# Altium project nrf52840_qfaa.PrjPCB
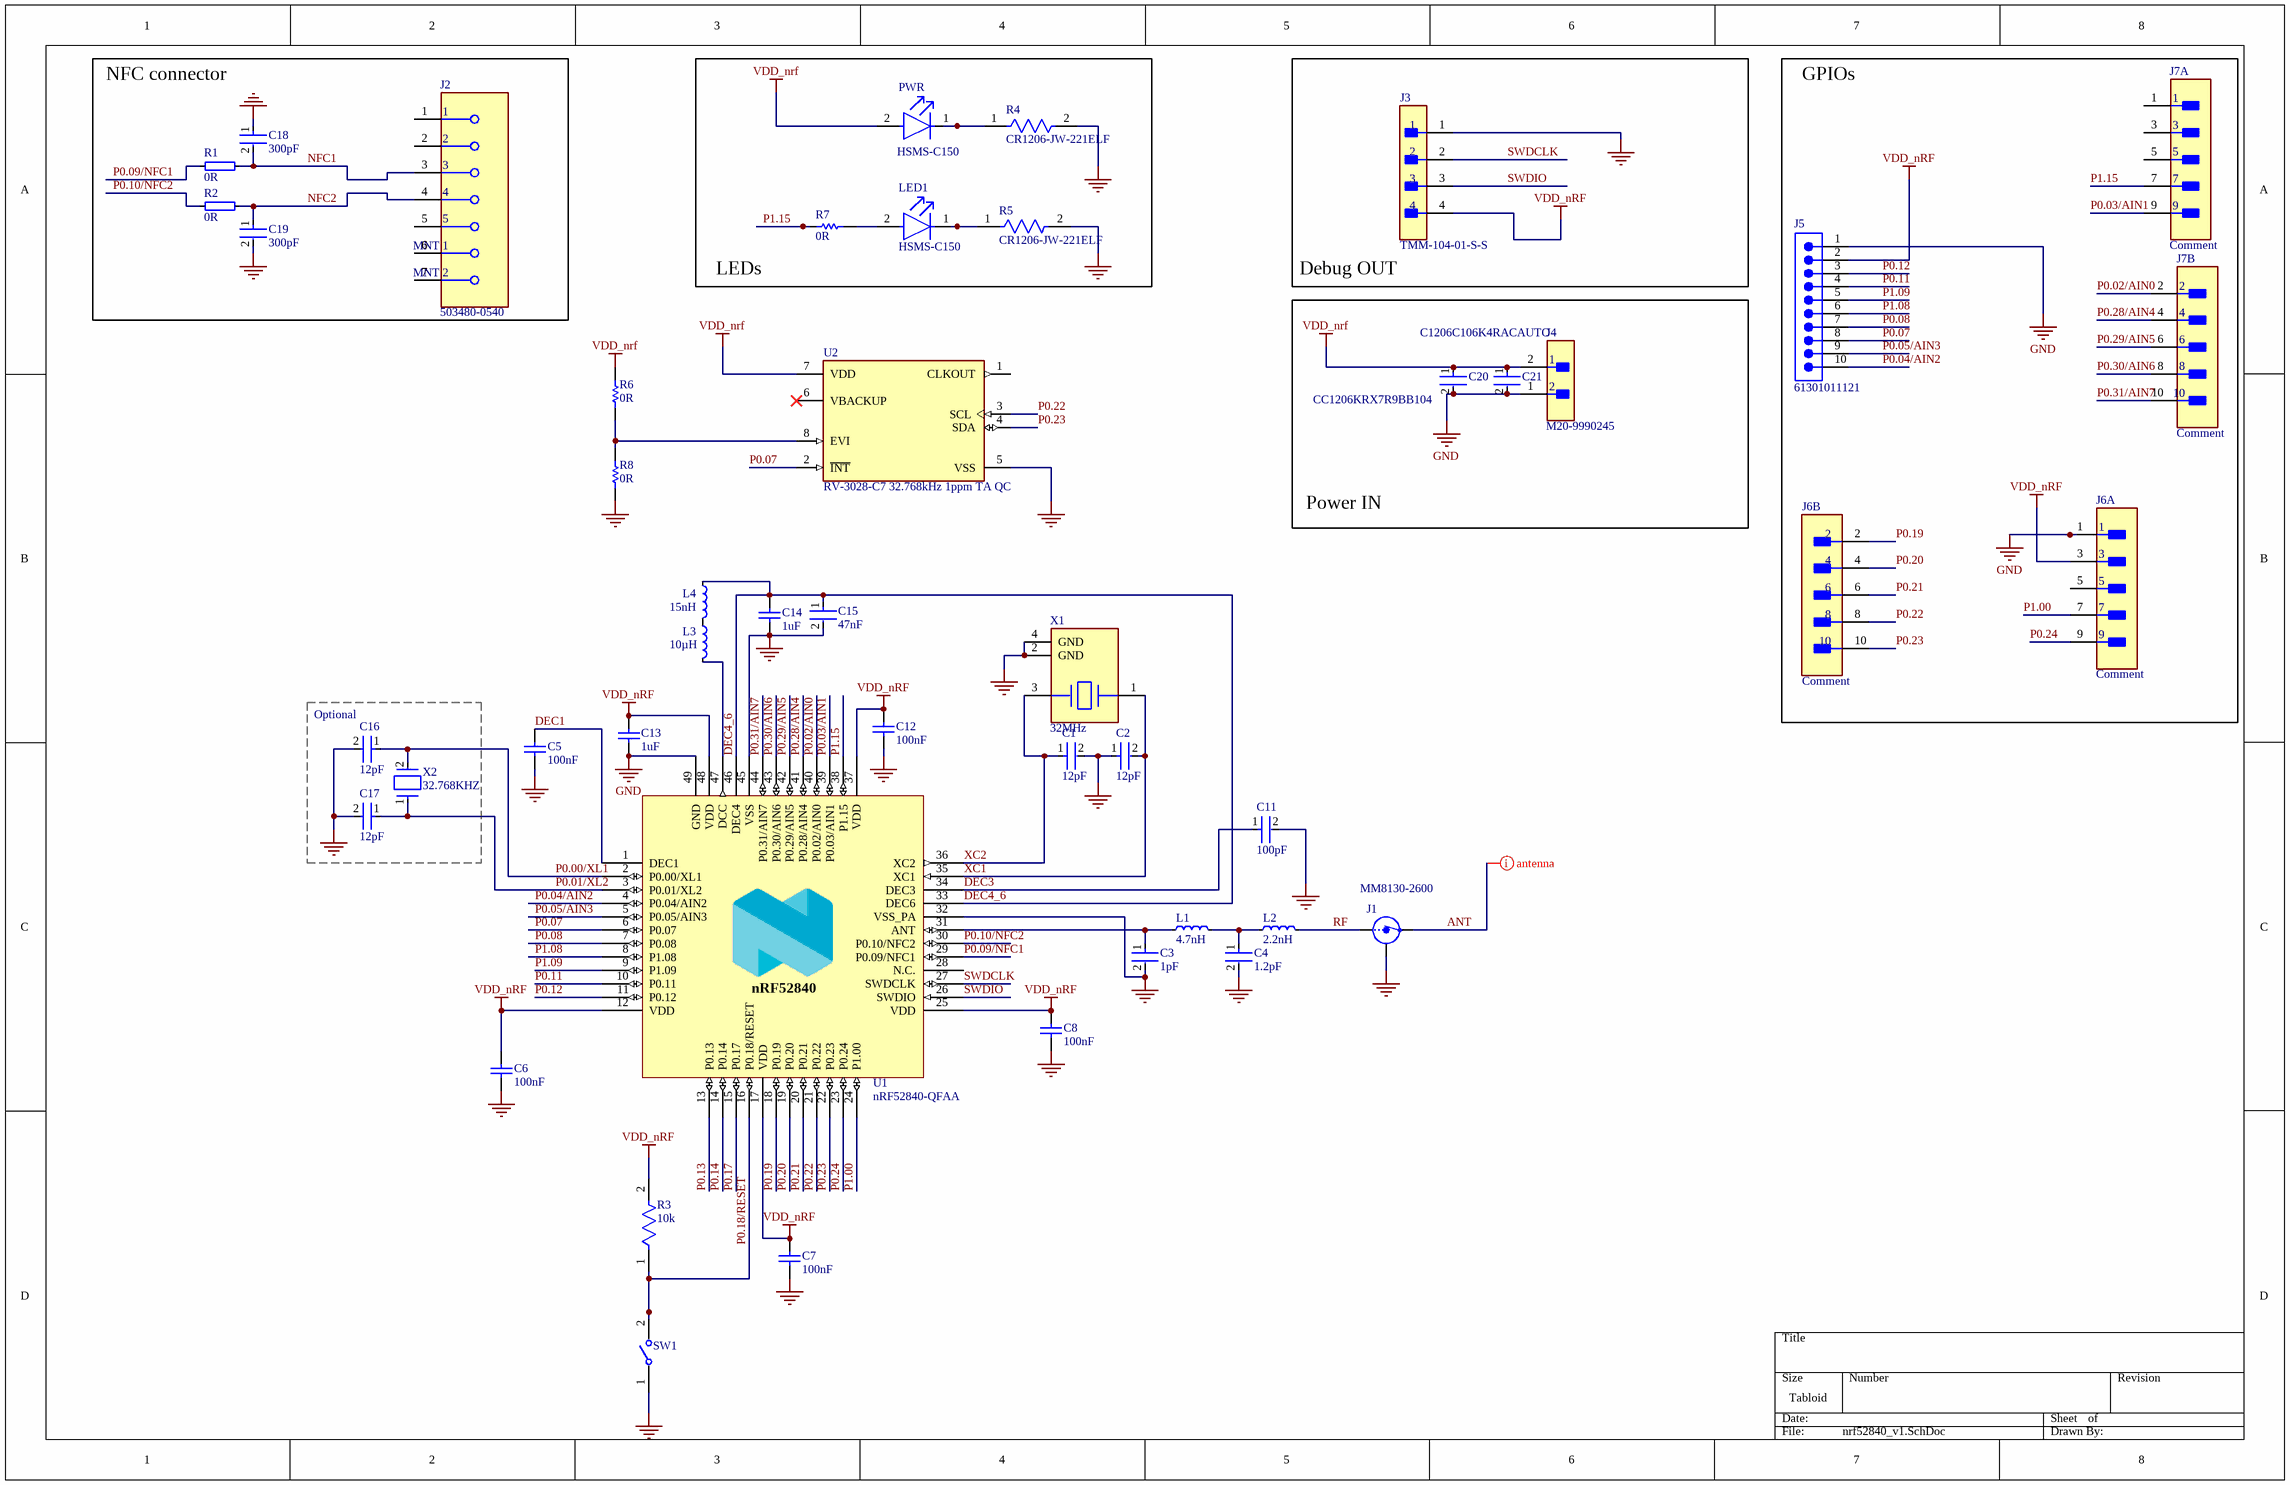
[diagram p0: nrf52840_v1.SchDoc]
1 sheet, 45 parts. Net scope: global (net labels, ports and power ports of the same name join across sheets).
Board files: pcb_full_revB.PcbDoc, pcb_full_revA.PcbDoc, pcb_full_revC.PcbDoc, pcb_full_revD.PcbDoc, test.PcbDoc

## Sheet nrf52840_v1.SchDoc
size Tabloid; Revision: 1.0; SheetNumber: 1; SheetTotal: 1; DrawnBy: RUBR; DocumentSize: A4; Device: nRF52840-QFAA; RefLayoutTitle: Reference Layout

### Parts
C1  12pF  [FP-C0402-BB-MFG]
C2  12pF  [FP-C0402-BB-MFG]
C3  1pF  [FP-C0402-BB-MFG]
C4  1.2pF  [FP-C0402-BB-MFG]
C5  100nF  [CAPC1005X55X30LL05T10]
C6  100nF  [CAPC1005X55X30LL05T10]
C7  100nF  [CAPC1005X55X30LL05T10]
C8  100nF  [CAPC1005X55X30LL05T10]
C11  100pF  [FP-C1206C-EB-MFG]
C12  100nF  [CAPC1005X55X30LL05T10]
C13  1uF  [CAPC1005X60X30NL05T10]
C14  1uF  [CAPC1005X60X30NL05T10]
C15  47nF  [FP-C0402-BB-MFG]
C16  12pF  [FP-C0402-BB-MFG]
C17  12pF  [FP-C0402-BB-MFG]
C18  300pF  [FP-C1206C-EB-MFG]
C19  300pF  [FP-C1206C-EB-MFG]
C20  CC1206KRX7R9BB104  [FP-CC1206-1_25-MFG]
C21  C1206C106K4RACAUTO  [FP-C1206C-EH-MFG]
J1  MM8130-2600  [COAXIAL-SWF]
J2  503480-0540  [FP-503480-0540-MFG]
J3  TMM-104-01-S-S  [FP-TMM-104-01-S-S-MFG]
J4  M20-9990245  [FP-M20-9990245-MFG]
J5  61301011121  [61301011121]
J6  Comment  [FP-10-89-7101-MFG]  (parts A,B of 2)
J7  Comment  [FP-10-89-7101-MFG]  (parts A,B of 2)
L1  4.7nH  [INDC0603X03L_C]
L2  2.2nH  [INDC0603X03L_C]
L3  10µH  [INDC1608X06L]
L4  15nH  [INDC1005X04L]
LED1  HSMS-C150  [FP-HSMS-C150-MFG]
PWR  HSMS-C150  [FP-HSMS-C150-MFG]
R1  0R  [RESC1005X04L]  (no BOM)
R2  0R  [RESC1005X04L]  (no BOM)
R3  10k  [FP-CR1206-IPC_B]
R4  CR1206-JW-221ELF  [FP-CR1206-MFG]
R5  CR1206-JW-221ELF  [FP-CR1206-MFG]
R6  0R  [RESC2013X60X35LL10T20]  (no BOM)
R7  0R  [RESC2013X60X35LL10T20]
R8  0R  [RESC2013X60X35LL10T20]  (no BOM)
SW1  (no value)  [FP-B3U-1000P-MFG]
U1  nRF52840-QFAA  [QFN40P600X600X90-48N]
U2  RV-3028-C7 32.768kHz 1ppm TA QC  [FP-RV-3028-C7_32_768kHz_1-MFG]
X1  32MHz  [FP-ABM11W-MFG]
X2  32.768KHZ  [FP-ABS06-MFG]

### Blocks framed on the sheet
NFC connector: C18 C19 J2 R1 R2
LEDs: LED1 PWR R4 R5 R7
Debug OUT: J3
GPIOs: J5-J7
Power IN: C20 C21 J4
Optional: C16 C17 X2

### Nets
GND: C1.2 C2.1 C3.2 C4.2 C5.1 C6.1 C7.1 C8.1 C11.2 C12.1 C13.1 C14.1 C15.2 C16.2 C17.2 C18.1 C19.2 C20.2 C21.2 J1.2(Shield) J3.1 J4.1 J5.1 J6.1 R4.2 R5.2 R8.1 SW1.1 U1.32(VSS_PA) U1.45(VSS) U1.49(GND) U2.5(VSS) X1.2(GND) X1.4(GND)
VDD_nRF: C6.2 C7.2 C8.2 C12.2 C13.2 C20.1 C21.1 J3.4 J4.2 J5.2 J6.3 PWR.2(A) R3.2 R6.2 U1.12(VDD) U1.17(VDD) U1.25(VDD) U1.37(VDD) U1.48(VDD) U2.7(VDD)
ANT: J1.3(OUT)
DEC1: C5.2 U1.1(DEC1)
DEC3: C11.1 U1.34(DEC3)
DEC4_6: C14.2 C15.1 L4.1 U1.33(DEC6) U1.46(DEC4)
NFC1: C18.2 J2.3 R1.1
NFC2: C19.1 J2.4 R2.1
P0.00/XL1: C16.1 U1.2(P0.00/XL1) X2.2
P0.01/XL2: C17.1 U1.3(P0.01/XL2) X2.1
P0.02/AIN0: J7.2 U1.40(P0.02/AIN0)
P0.03/AIN1: J7.9 U1.39(P0.03/AIN1)
P0.04/AIN2: J5.10 U1.4(P0.04/AIN2)
P0.05/AIN3: J5.9 U1.5(P0.05/AIN3)
P0.07: J5.8 U1.6(P0.07) U2.2(~{INT})
P0.08: J5.7 U1.7(P0.08)
P0.09/NFC1: R1.2 U1.29(P0.09/NFC1)
P0.10/NFC2: R2.2 U1.30(P0.10/NFC2)
P0.11: J5.4 U1.10(P0.11)
P0.12: J5.3 U1.11(P0.12)
P0.13: U1.13(P0.13)
P0.14: U1.14(P0.14)
P0.17: U1.15(P0.17)
P0.18/RESET: R3.1 SW1.2 U1.16(P0.18/RESET)
P0.19: J6.2 U1.18(P0.19)
P0.20: J6.4 U1.19(P0.20)
P0.21: J6.6 U1.20(P0.21)
P0.22: J6.8 U1.21(P0.22) U2.3(SCL)
P0.23: J6.10 U1.22(P0.23) U2.4(SDA)
P0.24: J6.9 U1.23(P0.24)
P0.28/AIN4: J7.4 U1.41(P0.28/AIN4)
P0.29/AIN5: J7.6 U1.42(P0.29/AIN5)
P0.30/AIN6: J7.8 U1.43(P0.30/AIN6)
P0.31/AIN7: J7.10 U1.44(P0.31/AIN7)
P1.00: J6.7 U1.24(P1.00)
P1.08: J5.6 U1.8(P1.08)
P1.09: J5.5 U1.9(P1.09)
P1.15: J7.7 R7.1 U1.38(P1.15)
RF: J1.1(IN) L2.2
SWDCLK: J3.2 U1.27(SWDCLK)
SWDIO: J3.3 U1.26(SWDIO)
XC1: C2.2 U1.35(XC1) X1.1
XC2: C1.1 U1.36(XC2) X1.3
NetC3_1: C3.1 L1.1 U1.31(ANT)
NetC4_1: C4.1 L1.2 L2.1
NetL3_1: L3.1 L4.2
NetL3_2: L3.2 U1.47(DCC)
NetLED1_1: LED1.1(C) R5.1
NetLED1_2: LED1.2(A) R7.2
NetPWR_1: PWR.1(C) R4.1
NetR6_1: R6.1 R8.2 U2.8(EVI)

Not connected (* = marked no-connect by the designer): J2 1 2 5 6(MNT_1) 7(MNT_2); J6 5; J7 1 3 5; U1 28(N.C.); U2 1(CLKOUT) 6(VBACKUP)*

### Layout directives
mark named antenna: ANT

### Notes on the sheet
- Title
- Size
- Date:
- A4
- Device
- Sheet         of
- Revision
- File:
- Drawn By:
- (in symbol nRF52840-QFAA) nRF52840

### Library data of the parts
C1 C2 C16 C17 = CMP-1034-00766-3: CAP CER 12PF 50V NP0 0402; Manufacturer: Kemet; Manufacturer Part Number: C0402C120D5GACTU; Material: Ceramic; Temperature Characteristic: C0G; Tolerance: 0.5 pF; Temperature Coefficient: 15%; Device Class L1: Passive Components; Ipc Land Pattern Name: CAPC10050X50; Temperature: -55°C to +125°C; Octopart: https://octopart.com/c0402c120d5gactu-kemet-15963451; Category: Cap; Mouser Description: Multilayer Ceramic Capacitors MLCC - SMD/SMT 50volts 12pF C0G Tol=0.5pF; RoHS: TRUE; Automotive: No; Lead Free: Yes; Value: 12 pF; Temperature Range High: +125°C; ComponentLink2URL: https://content.kemet.com/datasheets/KEM_C1002_X7R_SMD.pdf; Temperature Range Low: -55°C; Digikey Description: CAP CER 12PF 50V NP0 0402; ComponentLink2Description: Datasheet; Device Class L2: Capacitors; Package: C0402-BB; Capacitance: 12 pF; Device Class L3: Ceramic Capacitors; Height: 0.55mm; Voltage Rating: 50 V
C3 = CMP-2008-03470-3: CAP CER 1PF 50V NP0 0402; Manufacturer: Kemet; Manufacturer Part Number: C0402C109C5GACTU; Capacitance: 1.0 pF; Temperature Characteristic: C0G; Tolerance: 0.25 pF; Temperature Coefficient: 15%; Value: 1.0 pF; Material: Ceramic; Automotive: No; Device Class L1: Passive Components; RoHS: TRUE; Device Class L2: Capacitors; Height: 0.55mm; Octopart: https://octopart.com/c0402c109c5gactu-kemet-9138550; Temperature Range Low: -55°C; ComponentLink2URL: https://content.kemet.com/datasheets/KEM_C1002_X7R_SMD.pdf; Temperature Range High: +125°C; ComponentLink2Description: Datasheet; Mouser Description: Multilayer Ceramic Capacitors MLCC - SMD/SMT 50volts 1.0pF C0G .25pF; Digikey Description: CAP CER 1PF 50V NP0 0402; Package: C0402-BB; Temperature: -55°C to +125°C; Ipc Land Pattern Name: CAPC10050X50; Category: Cap; Device Class L3: Ceramic Capacitors; Voltage Rating: 50 V; Lead Free: Yes
C4 = CMP-2008-03099-3: CAP CER 1.2PF 50V C0G/NP0 0402; Manufacturer Part Number: C0402C129C5GACTU; Manufacturer: Kemet; Temperature Characteristic: C0G; Material: Ceramic; Temperature Coefficient: 15%; Tolerance: 0.25 pF; ComponentLink2URL: https://content.kemet.com/datasheets/KEM_C1002_X7R_SMD.pdf; Temperature Range High: +125°C; Mouser Description: Cap Ceramic 1.2pF 50V C0G 0.25pF SMD 0402 125°C Paper T/R; Temperature: -55°C to +125°C; Voltage Rating: 50 V; Package: C0402-BB; Octopart: https://octopart.com/c0402c129c5gactu-kemet-193076; Device Class L2: Capacitors; Category: Cap; Digikey Description: CAP CER 1.2PF 50V C0G/NP0 0402; Device Class L3: Ceramic Capacitors; Capacitance: 1.2 pF; Device Class L1: Passive Components; Temperature Range Low: -55°C; Ipc Land Pattern Name: CAPC10050X50; Value: 1.2 pF; Lead Free: Yes; Height: 0.55mm; ComponentLink2Description: Datasheet; RoHS: TRUE; Automotive: No
C5-C8 C12 = CMP-0001-00074-2: Manufacturer: Kemet; Part Number: C0402C104K4RACTU
C11 = CMP-03020-032313-1: CAP CER 100PF 50V 10% NP0 1206; Manufacturer Part Number: C1206C101K5GACTU; Manufacturer: KEMET; Automotive Grade: Grade 0; Temperature Coefficient: 15%; Material: Ceramic; Tolerance: 0.1; Temperature Characteristic: C0G; Temperature: -55°C to +150°C; Automotive: Yes; Mouser Description: Multilayer Ceramic Capacitors MLCC - SMD/SMT 50volts 100pF C0G 10%; Value: 100 pF; Ipc Land Pattern Name: CAPC320160X78; RoHS: TRUE; ComponentLink2URL: https://content.kemet.com/datasheets/KEM_C1007_X8R_ULTRA_150C_SMD.pdf; Height: 0.88mm; Lead Free: Yes; Octopart: https://octopart.com/c1206c101k5gactu-kemet-9138650; Voltage Rating: 50 V; Temperature Range Low: -55°C; Digikey Description: CAP CER 100PF 50V 10% NP0 1206; Package: C1206C-EB; Capacitance: 100 pF; Device Class L2: Capacitors; Category: Cap; ComponentLink2Description: Datasheet; Device Class L3: Ceramic Capacitors; Device Class L1: Passive Components; Temperature Range High: +150°C
C13 C14 = CMP-2008-02056-1: Part Number: C0402C105M8PACTU; Manufacturer: Kemet
C15 = CMP-2008-03220-2: CAP CER 0.047UF 25V 10% X7R 0402; Manufacturer Part Number: C0402C473K3RACTU; Manufacturer: Kemet; Capacitance: 47,000 pF; Material: Ceramic; Tolerance: 0.1; Value: 47,000 pF; Temperature Coefficient: 15%; Category: Cap; Octopart: https://octopart.com/c0402c473k3ractu-kemet-108381; ComponentLink2URL: https://content.kemet.com/datasheets/KEM_C1002_X7R_SMD.pdf; Lead Free: Yes; Package: C0402-BB; ComponentLink2Description: Datasheet; RoHS: TRUE; Temperature: -55°C to +125°C; Ipc Land Pattern Name: CAPC10050X50; Device Class L1: Passive Components; Device Class L2: Capacitors; Digikey Description: CAP CER 0.047UF 25V 10% X7R 0402; Height: 0.55mm; Voltage Rating: 25 V; Temperature Range High: +125°C; Device Class L3: Ceramic Capacitors; Automotive: No; Temperature Characteristic: X7R; Temperature Range Low: -55°C; Mouser Description: Multilayer Ceramic Capacitors MLCC - SMD/SMT 25volts 47000pF X7R 10%
C18 C19 = CMP-1037-01976-2: CAP CER 300PF 50V 5% NP0 1206; Manufacturer: KEMET; Manufacturer Part Number: C1206C301J5GACTU; Tolerance: 0.05; Temperature Coefficient: 15%; Automotive Grade: Grade 0; Temperature Characteristic: C0G; Material: Ceramic; Automotive: Yes; Capacitance: 300 pF; Temperature: -55°C to +150°C; Package: C1206C-EB; Octopart: https://octopart.com/c1206c301j5gactu-kemet-12563790; Device Class L1: Passive Components; Height: 0.88mm; Category: Cap; Device Class L2: Capacitors; Lead Free: Yes; Device Class L3: Ceramic Capacitors; ComponentLink2Description: Datasheet; Value: 300 pF; Mouser Description: Cap Ceramic 300pF 50V C0G 5% SMD 1206 125°C Plastic T/R; Ipc Land Pattern Name: CAPC320160X78; ComponentLink2URL: https://content.kemet.com/datasheets/KEM_C1007_X8R_ULTRA_150C_SMD.pdf; Temperature Range High: +150°C; Voltage Rating: 50 V; RoHS: TRUE; Digikey Description: CAP CER 300PF 50V 5% NP0 1206; Temperature Range Low: -55°C
C20 = CMP-03422-000842-1: CAP CER 0.1UF 50V X7R 1206; Manufacturer: Yageo; Automotive Grade: NA; Value: 100 nF; Tolerance: 0.1; Material: Ceramic; Temperature Coefficient: 15%; Temperature Characteristic: X7R; Device Class L1: Passive Components; Lead Free: Yes; Octopart: https://octopart.com/cc1206krx7r9bb104-yageo-39467816; Category: Cap; Temperature Range Low: -55°C; Device Class L3: Ceramic Capacitors; Voltage Rating: 50 V; Temperature Range High: +125°C; Device Class L2: Capacitors; RoHS: TRUE; Package: CC1206-1.25; Footprint Url: http://www.yageo.com/exep/pages/download/literatures/UPY-C_GEN_24.pdf; ComponentLink2Description: Datasheet; Temperature: -55°C to +125°C; Capacitance: 100 nF; Digikey Description: CAP CER 0.1UF 50V X7R 1206; Height: 1.45mm; Automotive: No; Mouser Description: Multilayer Ceramic Capacitors MLCC - SMD/SMT 100nF 50V X7R 10%; ComponentLink2URL: http://www.yageo.com/documents/recent/UPY-NP0X7R_HV_1KV-to-3KV_11.pdf; Manufacturer Part Number: CC1206KRX7R9BB104
C21 = CMP-03020-003375-1: CAP CER 10UF 16V X7R 1206; Manufacturer: Kemet; Material: Ceramic; Temperature Coefficient: 15%; Tolerance: 10%; Automotive Grade: Grade 1; Manufacturer Part Number: C1206C106K4RACAUTO; Digikey Description: CAP CER 10UF 16V X7R 1206; RoHS: TRUE; Temperature Range Low: -55°C; Ipc Land Pattern Name: CAPC320160X160; Category: Cap; Mouser Description: Multilayer Ceramic Capacitors MLCC - SMD/SMT 10uF 16V 10% AUTO; Device Class L1: Passive Components; Automotive: Yes; ComponentLink2Description: Datasheet; Octopart: https://octopart.com/c1206c106k4racauto-kemet-20072893; Package: C1206C-EH; Temperature: -55°C to +125°C; Device Class L3: Ceramic Capacitors; Device Class L2: Capacitors; Temperature Range High: +125°C; Capacitance: 10uF; Value: 10uF; Lead Free: Yes; Height: 1.8mm; Temperature Characteristic: X7R; ComponentLink2URL: https://content.kemet.com/datasheets/KEM_C1023_X7R_AUTO_SMD.pdf; Voltage Rating: 16V
J1 = MM8130-2600: Coaxial Connector with Switch; Manufacturer: Murata; Part number IPS: 00000009955; Note: N.A.; Artikkelnr Noca: 55029011; Pad Count: 3; Part Number: MM8130-2600; Manufacturer Part Number: MM8130-2600; LatestRevisionDate: 2014-04-24; Pin Count: 3; Publisher: Nordic Semiconductor; Published: 2014-04-24; Value: MM8130-2600; Footprint Doc: COAXIAL-SWF; ComponentLink1URL: N.A.; ComponentLink1Description: Datasheet; ComponentLink2URL: N.A.; ComponentLink2Description: Supplier link; HelpURL: http://www.murata.com/products/catalog/pdf/o33e.pdf; Supplier 1: Digi-Key; Supplier Part Number 1: 490-4981-1-ND; Supplier 2: Mouser; Supplier Part Number 2: 81-MM8130-2600RA2; Author: rsk; Component Class: Connectors; PartId: 100500400; Part number Norautron: N.A.
J2 = CMP-00257-52963780-1: 503480-0540 Connector FFC/FPC SKT 5 Position 0.5mm Solder Right Angle Surface Mount T/R; Manufacturer Lifecycle Status: ACTIVE; Actuator Material: Glass, Nylon, Polyamide; Number of Positions: 5; Pitch: 508µm; Plating: Gold; Voltage Rating: 50V; Current Rating: 500mA; Wire/Cable Type: Straight; Contact Plating: Gold; Termination: Solder; Country of Origin: KR; Number of Rows: 1; RoHS: Compliant; NexarPartId: 52963780; Max Operating Temperature: 85°C; Lifecycle Status: Production; Mount: Surface Mount; Halogen Free: Low Halogen; Height: 2.07mm; Housing Material: Polymer; Number of Circuits: 5; Number of Contacts: 5; Min Operating Temperature: -40°C; Flammability Rating: UL94 V-0; Contact Material: Bronze, Gold, Nickel; Orientation: Right Angle
J3 = CMP-02766-001674-1: CONN HEADER VERT 4POS 2MM; Max Current Rating: 3.9A; Connector Type: Male Pin; Max Voltage Rating (AC): 500V; Number of Contacts: 4; Gender: Male; Color: Black; Packaging: Bulk; Orientation: Straight; Contact Mating Length: 0.126inch; Contact Plating: Gold; Max Operating Temperature: 125°C; Housing Color: Black; Contact Material: Bronze; Package Quantity: 1; Housing Material: Polymer; Radiation Hardening: No; Pitch: 2mm; Contact Type: Male Pin; Number of Positions: 4; Number of Rows: 1; Lead Free: Lead Free; Width: 1.97mm; Termination: Solder; Depth: 1.97mm; Series: FleXYZ™ TMM; RoHS Compliant: Yes; Length: 8mm; Min Operating Temperature: -55°C; Mount: Through Hole
J4 = CMP-15831-000105-1: CONN HEADER VERT 2POS 2.54MM; Working Voltage: 750V; Gender: Male; Number of Poles: 2; Current Rating: 3A; Mated Stacking Heights: 16.54mm; Contact Resistance: 25mR; Connector Type: Male Pin; Insulation Resistance: 10GR; Mating Cycles: 300; Voltage: 50V; Flammability Rating: UL94 V-0; Pitch: 2.54mm; Series: M20; Number of Contacts: 2; Height: 0.12inch; Min Operating Temperature: -40°C; Contact Finish - Mating: GOLD; Number of Positions: 2; Number of Rows: 1; Packaging: Bulk; Package Quantity: 1000; Voltage Rating (AC): 750V; Current: 3A; Mount: Through Hole; Case/Package: SIL; Orientation: Straight; Contact Shape: Square; Weight: 0.25lb; Radiation Hardening: No; Fastening Type: Pull; Length: 5.08mm; Depth: 2.54mm; Contact Mating Length: 0.24inch; Housing Material: Nylon; Reach SVHC Compliant: Yes; Insulation Material: Nylon; Color: Black; Width: 0.25inch; Insulation Color: Black; Contact Material: Brass; Contact Type: Male Pin; Termination: Solder; Max Operating Temperature: 105°C; Contact Plating: Gold; Housing Color: Black; Max Current Rating: 3A; Lead Pitch: 2.54mm
J5 = CMP-1502-01082-4: NexarPartId: 18818159; Operating Supply Voltage: 250V; Insulation Resistance: 1GΩ; Contact Resistance: 20mΩ; Current Rating: 3A; Connector Type: Male Pin; Gender: Male; Number of Contacts: 10; Pitch: 2.54mm; REACH SVHC: Unknown; Min Operating Temperature: -40°C; Max Operating Temperature: 105°C; Height: 8.74mm; Packaging: Bulk; Orientation: Vertical; Number of Pins: 10; Contact Mating Length: 5.9944mm; Voltage Rating: 250V; Number of Positions: 10; Termination: Solder; Number of Rows: 1; Contact Material: Copper; Housing Material: PBT; Mount: Through Hole; Lead Pitch: 2.54mm; Contact Plating: Gold; Contact Gender: Male; Color: Black; Flammability Rating: UL94 V-0; RoHS: Compliant; Width: 25.4mm; Length: 2.54mm
J6 J7 = CMP-04776-000908-1: CONN HEADER VERT 10POS 2.54MM; Contact Resistance: 15mR; Voltage Rating: 250V; Row Spacing: 0.1inch; Number of Positions: 10; Gender: Male; Max Current Rating: 1A; Connector Type: Male Pin; Current Rating: 3A; Depth: 5.08mm; Height: 15.97mm; Package Quantity: 1; Series: C-Grid® 70280; Min Operating Temperature: -40°C; Max Operating Temperature: 105°C; Contact Type: Male Pin; Housing Color: Black; Contact Mating Length: 0.24inch; Contact Gender: Male; Pitch: 2.54mm; Number of Rows: 2; Contact Material: Brass; Termination: Solder; Number of Contacts: 10; Housing Material: Thermoplastic; Packaging: Bulk; Length: 12.7mm; Contact Plating: Tin; Color: Black; Mount: Through Hole; RoHS Compliant: Yes; Orientation: Straight
L1 = L0201-4n7: High frequency chip inductor ±5%; Pad Count: 2; Part Number: L0201-4n7; LatestRevisionDate: 2013-04-10; Published: 2013-04-10; Value: 4.7nH; Footprint Doc: 0201; Component Class: Inductors
L2 = L0201-2n2: High frequency chip inductor ±5%; Pad Count: 2; Part Number: L0201-2n2; LatestRevisionDate: 2013-04-10; Published: 2013-04-10; Value: 2.2nH; Footprint Doc: 0201; Component Class: Inductors
L3 = L0603-10µ-TDK: Chip inductor, IDC,min = 50 mA, ±20%; Pad Count: 2; Part Number: L0603-10µ-TDK; LatestRevisionDate: 2012-09-19; Published: 2019-05-06; Value: 10µH; Footprint Doc: 0603; Component Class: Inductors
L4 = L0402-15n: High frequency chip inductor ±10%; Pad Count: 2; Part Number: L0402-15n; LatestRevisionDate: 2012-09-19; Published: 2010-07-12; Value: 15nH; Footprint Doc: 0402; Component Class: Inductors
LED1 PWR = CMP-21615-000001-1: LED RED DIFFUSED CHIP SMD; Luminous Intensity: 10mcd; Power Dissipation: 65mW; Viewing Angle: 170°; Number of Elements: 1; Forward Current: 20mA; Lens Color: White; Lens Style: Rectangular; Wavelength: 626nm; Forward Voltage: 2.1V; Reverse Voltage: 5V; Number of Pins: 2; Color: Red; Lead Free: Lead Free; Width: 1.6mm; Length: 3.2mm; REACH SVHC: No SVHC; Height: 1.1mm; Depth: 1.6mm; Power Rating: 65mW; Package Quantity: 1; Illumination Color: Red; Radiation Hardening: No; Case Code (Imperial): 1206; Max Operating Temperature: 85°C; Test Current: 20mA; Case/Package: 1206; Lens Transparency: Diffused; Number of LEDs: 1; Packaging: Tape and Reel; Mount: Surface Mount; Min Operating Temperature: -40°C; Case Code (Metric): 3216; Dominant Wavelength: 626nm
R1 R2 = R0402-0R: Resistor, ±5%, 0.063W; Manufacturer: N.A.; Part number IPS: 00000007128; Note: Chip Res 5%; Artikkelnr Noca: 27049000; Pad Count: 2; Part Number: R0402-0R; Manufacturer Part Number: N.A.; Footprint Doc: 0402; LatestRevisionDate: 2009-11-23; Pin Count: 2; Publisher: Nordic Semiconductor; Published: 2009-05-08; Value: 0R; ComponentLink1URL: N.A.; ComponentLink1Description: Datasheet; ComponentLink2URL: N.A.; ComponentLink2Description: Supplier link; HelpURL: N.A.; Supplier 1: Farnell; Supplier Part Number 1: 146-9661; Supplier 2: N.A.; Supplier Part Number 2: N.A.; Author: rsk; Component Class: Resistors; PartId: 100100109; Part number Norautron: N.A.
R3 = CMP-07231-005593-1: Thick Film Chip Resistors 1206 10kΩ 0.25W 5% 200ppm/°C; Voltage Rating: 200V; Resistance: 10kR; Max Power Dissipation: 250mW; Temperature Coefficient: 200ppm/°C; Height: 0.6mm; Case Code (Imperial): 1206; REACH SVHC: No SVHC; Depth: 1.6mm; Mount: Surface Mount; Termination: SMD/SMT; Case/Package: 1206; Min Operating Temperature: -55°C; Features: Moisture Resistant; Number of Pins: 2; Length: 3.2mm; Military Standard: Not; Radiation Hardening: No; Max Operating Temperature: 155°C; Power Rating: 250mW; Case Code (Metric): 3216; Package Quantity: 1; Composition: Thick Film; Tolerance: 5%; Voltage Rating (DC): 200V; Contact Plating: Tin; Thickness: 610um; Number of Terminations: 2; Packaging: Tape and Reel; Width: 1.6mm
R4 R5 = CMP-07231-003298-1: Thick Film Chip Resistors 1206 220Ω 0.25W 5% 200ppm/°C; Power Rating: 250mW; Resistance: 220R; Voltage Rating: 200V; Width: 0.063inch; Package Quantity: 5000; Tolerance: 5%; Packaging: Tape and Reel; Composition: Thick Film; Thickness: 610um; Case/Package: 1206; Temperature Coefficient: 200ppm/°C; Contact Plating: Tin; Case Code (Metric): 3216; Number of Terminations: 2; Case Code (Imperial): 1206; Features: Moisture Resistant; Termination: SMD/SMT; Radiation Hardening: No; Mount: Surface Mount; Max Operating Temperature: 155°C; Max Power Dissipation: 250mW; Min Operating Temperature: -55°C; Length: 0.126inch; Height: 0.03inch
R6-R8 = CMP-2001-01414-1: Part Number: RC0805JR-130RL; Manufacturer: Yageo
SW1 = CMP-2100-03586-2: SWITCH TACTILE SPST-NO 0.05A 12V; Contact Resistance: 100mR; Operating Force: 1.5N; Max Current Rating: 50mA; Switch Travel: 0.15mm; Actuator Type: Standard; Mechanical Life: 200000Cycles; Ratings: Dust Proof; Illumination Type: Non-Illuminated; Throw Configuration: SPST; Actuator Length: 0.4mm; Switch Function: Off-Mom; Height: 1.2mm; Width: 3mm; Weight: 0.000776oz; Contact Material: Silver; Max Voltage Rating (DC): 12V; Insulation Resistance: 100MR; Lead Free: Lead Free; Current Rating: 50mA; Termination: SMD/SMT; Length: 4mm; Voltage Rating (DC): 12V; Contact Current Rating: 50mA; Orientation: Straight; Depth: 2.5mm; Max Operating Temperature: 70°C; Packaging: Tape and Reel; Min Operating Temperature: -25°C; Package Quantity: 1; Mount: Surface Mount; Electrical Life: 200000Cycles
U1 = nRF52840-QFAA: Multi-protocol Bluetooth Low Energy, IEEE 802.15.4, ANT and 2.4GHz proprietary system-on-chip; Pad Count: 48; Part Number: nRF52840-QFAA; LatestRevisionDate: 2016-11-22; Published: 2016-03-31; Value: nRF52840-QFAA; Footprint Doc: QFN-48; Component Class: nRF_Devices
U2 = CMP-226158-000001-1: Real Time Clock Serial 2byte Clock/Calendar/Alarm/Timer/Battery Backup 8-Pin CSMD T/R; Manufacturer: Micro Crystal; Memory Size: 2Bytes; Number Of Outputs: 1; Nominal Supply Current: 0.04uA; Interface: I2C; Max Supply Voltage: 5.5V; Min Supply Voltage: 1.1V; Package: RV-3028-C7 32.768kHz 1ppm TA QC; Lead Free: Yes; RoHS: TRUE; Device Class L1: Integrated Circuits (ICs); Temperature: -40°C to +85°C; ComponentLink2Description: Datasheet; Height: 0.8mm; Octopart: https://octopart.com/rv-3028-c7+32.768khz+1ppm+ta+qc-micro+crystal-98880451; ComponentLink2URL: https://www.microcrystal.com/fileadmin/Media/Products/RTC/Datasheet/RV-3028-C7.pdf; Device Class L2: Clock and Timing; Temperature Range Low: -40°C; Temperature Range High: +85°C; Automotive: No; Device Class L3: Real Time Clocks; Manufacturer Part Number: RV-3028-C7 32.768kHz 1ppm TA QC; Frequency: 32.768kHz; Ambient Temperature Range High: +85°C; Ambient Temperature Range Low: -40°C; Category: IC; Mouser Description: RV-3028-C7 32.768KHZ 1PPM Ta Qc
X1 = CMP-27762-001068-1: CRYSTAL 32.0000MHZ 8PF SMD; Frequency Tolerance: 10ppm; Frequency Stability: 20ppm; ESR (Equivalent Series Resistance): 80R; Load Capacitance: 8pF; Packaging: Tape and Reel; Mount: Surface Mount; Min Operating Temperature: -40°C; RoHS Compliant: Yes; Max Operating Temperature: 85°C; Case/Package: SMD/SMT; Frequency: 32MHz
X2 = CMP-27762-015421-1: Crystal 32.768kHz ±20ppm (Tol) 9pF FUND 90kΩ 2-Pin Mini-CSMD T/R; ESR (Equivalent Series Resistance): 90kR; Max Operating Temperature: 85°C; Frequency Tolerance: 20ppm; Case/Package: CSMD; Termination: SMD/SMT; RoHS Compliant: Yes; Height: 0.6mm; Load Capacitance: 9pF; Packaging: Tape and Reel; Depth: 1.2mm; Tolerance: 20ppm; Frequency: 32.768kHz; Series: ABS06; Width: 1.2mm; Length: 2mm; Number of Pins: 2; Min Operating Temperature: -40°C; Mount: Surface Mount; Lead Free: Lead Free; Package Quantity: 3000